# Altium schematic sheet EtherWiz_Sockets.SchDoc
size A3; SheetNumber: 3; SheetTotal: 3
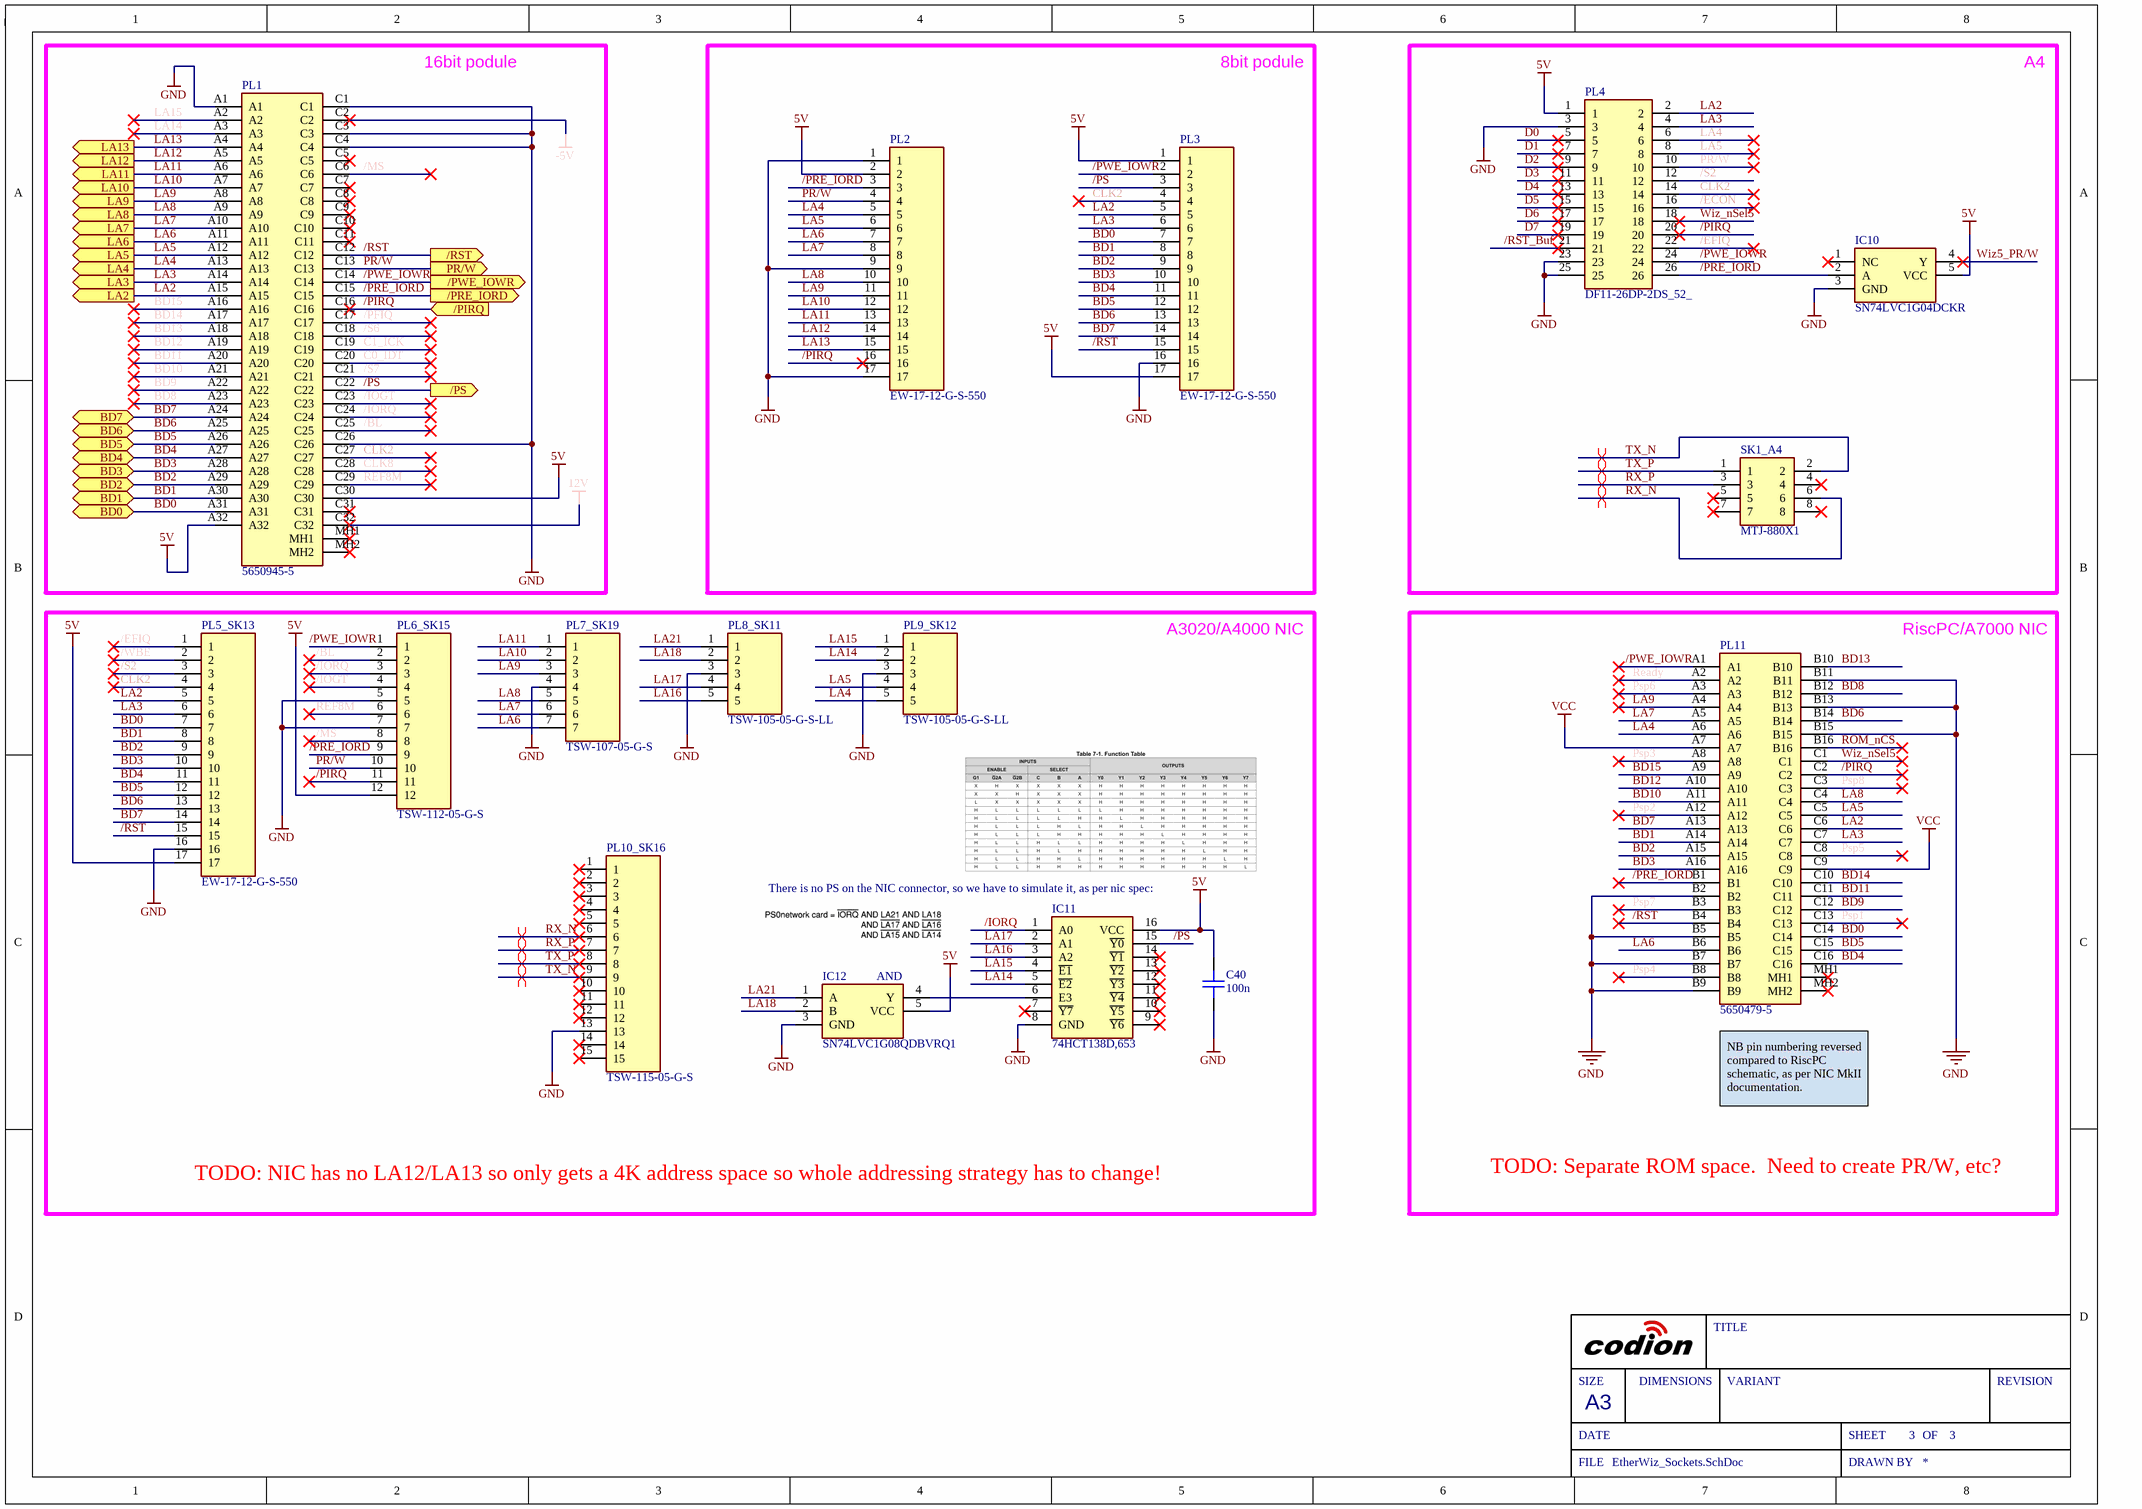
[diagram p0: EtherWiz_Sockets.SchDoc]

## Parts
C40  100n  [CAPC1608L]
IC10  SN74LVC1G04DCKR  [SOT65P210X110-5N]
IC11  74HCT138D,653  [SOIC127P600X175-16N]
IC12  SN74LVC1G08QDBVRQ1  [SOT95P280X145-5N]
PL1  5650945-5  [56509455]
PL2  EW-17-12-G-S-550  [TSW-117-XX-YY-S]
PL3  EW-17-12-G-S-550  [TSW-117-XX-YY-S]
PL4  DF11-26DP-2DS_52_  [SHDRRA26W50P200_2X13_2800X1000X500P]
PL5_SK13  EW-17-12-G-S-550  [TSW-117-XX-YY-S]
PL6_SK15  TSW-112-05-G-S  [TSW-112-XX-YY-S]
PL7_SK19  TSW-107-05-G-S  [TSW-107-XX-YY-S]
PL8_SK11  TSW-105-05-G-S-LL  [HDRV5W64P0X254_1X5_1270X254X521P]
PL9_SK12  TSW-105-05-G-S-LL  [HDRV5W64P0X254_1X5_1270X254X521P]
PL10_SK16  TSW-115-05-G-S  [TSW-115-XX-YY-S]
PL11  5650479-5  [56504795]
SK1_A4  MTJ-880X1  [MTJ880X1]

## Blocks framed on the sheet
16bit podule: PL1
8bit podule: PL2 PL3
A4: IC10 PL4 SK1_A4
A3020/A4000 NIC: C40 IC11 IC12 PL5_SK13 PL6_SK15 PL7_SK19 PL8_SK11 PL9_SK12 PL10_SK16
TODO: Separate ROM space.  Need to create PR/W, etc?: PL11

## Ports
/PIRQ (in, see EtherWiz[3D]), /PRE_IORD (out, see EtherWiz[6A]), /PS (out, see EtherWiz[6A]), /PWE_IOWR (out, see EtherWiz[6A]), /RST (out, see EtherWiz[2B]), BD0 (bidir, see EtherWiz[5B]), BD1 (bidir, see EtherWiz[5A]), BD2 (bidir, see EtherWiz[5A]), BD3 (bidir, see EtherWiz[5A]), BD4 (bidir, see EtherWiz[5A]), BD5 (bidir, see EtherWiz[5A]), BD6 (bidir, see EtherWiz[5A]), BD7 (bidir, see EtherWiz[5A]), LA2 (out, see EtherWiz[6A]), LA3 (out, see EtherWiz[6A]), LA4 (out, see EtherWiz[2B]), LA5 (out, see EtherWiz[2B]), LA6 (out, see EtherWiz[1B]), LA7 (out, see EtherWiz[1B]), LA8 (out, see EtherWiz[1B]), LA9 (out, see EtherWiz[1B]), LA10 (out, see EtherWiz[1A]), LA11 (out, see EtherWiz[1A]), LA12 (out, see EtherWiz[6A]), LA13 (out, see EtherWiz[6A]), PR/W (out, see EtherWiz[6A])

## Nets
5V: C40.2 IC10.5(VCC) IC11.16(VCC) IC12.5(VCC) PL1.A32 PL1.C30 PL2.2 PL3.1 PL3.17 PL4.1 PL5_SK13.17 PL6_SK15.12
12V: PL1.C32
-5V: PL1.C2
GND: C40.1 IC10.3(GND) IC11.8(GND) IC12.3(GND) PL1.A1 PL1.C1 PL1.C3 PL1.C4 PL1.C26 PL2.1 PL2.9 PL2.17 PL3.16 PL4.3 PL4.23 PL4.25 PL5_SK13.16 PL6_SK15.5 PL6_SK15.7 PL7_SK19.4 PL8_SK11.3 PL9_SK12.3 PL10_SK16.13 PL11.B2 PL11.B5 PL11.B7 PL11.B9 PL11.B11 PL11.B13 PL11.B15
VCC: PL11.A7 PL11.C9
/BL: PL1.C25 PL6_SK15.2
/ECON: PL4.16
/EFIQ: PL4.22 PL5_SK13.1
/IOGT: PL1.C23 PL6_SK15.4
/IORQ: IC11.1(A0) PL1.C24 PL6_SK15.3
/MS: PL1.C6 PL6_SK15.8
/PFIQ: PL1.C17
/PIRQ: PL1.C16 PL2.16 PL4.20 PL6_SK15.11 PL11.C2 ; port /PIRQ
/PRE_IORD: IC10.2(A) PL1.C15 PL2.3 PL4.26 PL6_SK15.9 PL11.B1 ; port /PRE_IORD
/PS: IC11.15(~{Y0}) PL1.C22 PL3.3 ; port /PS
/PWE_IOWR: PL1.C14 PL3.2 PL4.24 PL6_SK15.1 PL11.A1 ; port /PWE_IOWR
/RST: PL1.C12 PL3.15 PL5_SK13.15 PL11.B4 ; port /RST
/RST_Buf: PL4.21
/S2: PL4.12 PL5_SK13.3
/S6: PL1.C18
/S7: PL1.C21
/WBE: PL5_SK13.2
BD0: PL1.A31 PL3.7 PL5_SK13.7 PL11.C14 ; port BD0
BD1: PL1.A30 PL3.8 PL5_SK13.8 PL11.A14 ; port BD1
BD2: PL1.A29 PL3.9 PL5_SK13.9 PL11.A15 ; port BD2
BD3: PL1.A28 PL3.10 PL5_SK13.10 PL11.A16 ; port BD3
BD4: PL1.A27 PL3.11 PL5_SK13.11 PL11.C16 ; port BD4
BD5: PL1.A26 PL3.12 PL5_SK13.12 PL11.C15 ; port BD5
BD6: PL1.A25 PL3.13 PL5_SK13.13 PL11.B14 ; port BD6
BD7: PL1.A24 PL3.14 PL5_SK13.14 PL11.A13 ; port BD7
BD8: PL1.A23 PL11.B12
BD9: PL1.A22 PL11.C12
BD10: PL1.A21 PL11.A11
BD11: PL1.A20 PL11.C11
BD12: PL1.A19 PL11.A10
BD13: PL1.A18 PL11.B10
BD14: PL1.A17 PL11.C10
BD15: PL1.A16 PL11.A9
C0_IDT: PL1.C20
C1_ICK: PL1.C19
CLK2: PL1.C27 PL3.4 PL4.14 PL5_SK13.4
CLK8: PL1.C28
D0: PL4.5
D1: PL4.7
D2: PL4.9
D3: PL4.11
D4: PL4.13
D5: PL4.15
D6: PL4.17
D7: PL4.19
LA2: PL1.A15 PL3.5 PL4.2 PL5_SK13.5 PL11.C6 ; port LA2
LA3: PL1.A14 PL3.6 PL4.4 PL5_SK13.6 PL11.C7 ; port LA3
LA4: PL1.A13 PL2.5 PL4.6 PL9_SK12.5 PL11.A6 ; port LA4
LA5: PL1.A12 PL2.6 PL4.8 PL9_SK12.4 PL11.C5 ; port LA5
LA6: PL1.A11 PL2.7 PL7_SK19.7 PL11.B6 ; port LA6
LA7: PL1.A10 PL2.8 PL7_SK19.6 PL11.A5 ; port LA7
LA8: PL1.A9 PL2.10 PL7_SK19.5 PL11.C4 ; port LA8
LA9: PL1.A8 PL2.11 PL7_SK19.3 PL11.A4 ; port LA9
LA10: PL1.A7 PL2.12 PL7_SK19.2 ; port LA10
LA11: PL1.A6 PL2.13 PL7_SK19.1 ; port LA11
LA12: PL1.A5 PL2.14 ; port LA12
LA13: PL1.A4 PL2.15 ; port LA13
LA14: IC11.5(~{E2}) PL1.A3 PL9_SK12.2
LA15: IC11.4(~{E1}) PL1.A2 PL9_SK12.1
LA16: IC11.3(A2) PL8_SK11.5
LA17: IC11.2(A1) PL8_SK11.4
LA18: IC12.2(B) PL8_SK11.2
LA21: IC12.1(A) PL8_SK11.1
PR/W: PL1.C13 PL2.4 PL4.10 PL6_SK15.10 ; port PR/W
Psp1: PL11.C13
Psp2: PL11.A12
Psp3: PL11.A8
Psp4: PL11.B8
Psp5: PL11.C8
Psp6: PL11.A3
Psp7: PL11.B3
Psp8: PL11.C3
Ready: PL11.A2
REF8M: PL1.C29 PL6_SK15.6
ROM_nCS: PL11.B16
RX_N: PL10_SK16.6 SK1_A4.6
RX_P: PL10_SK16.7 SK1_A4.3
TX_N: PL10_SK16.9 SK1_A4.2
TX_P: PL10_SK16.8 SK1_A4.1
Wiz5_PR/W: IC10.4(Y)
Wiz_nSel5: PL4.18 PL11.C1
NetIC11_6: IC11.6(E3) IC12.4(Y)

Not connected (* = marked no-connect by the designer): IC10 1(NC)*; IC11 7(~{Y7})* 9(~{Y6})* 10(~{Y5})* 11(~{Y4})* 12(~{Y3})* 13(~{Y2})* 14(~{Y1})*; PL1 C5* C7* C8* C9* C10* C11* C31* MH1* MH2*; PL10_SK16 1* 2* 3* 4* 5* 10* 11* 12* 14* 15*; PL11 MH1* MH2*; SK1_A4 4* 5* 7* 8*

## Layout directives
differential pair: RX_N, RX_P, TX_N, TX_P

## Notes on the sheet
- RiscPC/A7000 NIC
- (near IC11) There is no PS on the NIC connector, so we have to simulate it, as per nic spec:
- (near IC12) AND
- (near PL11) NB pin numbering reversed compared to RiscPC schematic, as per NIC MkII documentation.
- TODO: NIC has no LA12/LA13 so only gets a 4K address space so whole addressing strategy has to change!
- SIZE
- DIMENSIONS
- TITLE
- VARIANT
- REVISION
- DATE
- A3
- SHEET
- OF
- FILE
- DRAWN BY

## Library data of the parts
C40 = CAP_100n_0603_50V_0: CAP 100nF, 0603, 50V, X7R, 10%; Manufacturer1: Samsung; ManuPart1: CL10B104KB8NNNC; ManuPart2: CC0603KRX7R9BB104; Value: 100n; Distributor1: Anglia; Manufacturer2: Yageo; Distributor2: Digikey; Distributor1 Part No: CL10B104KB8NNNC; Distributor2 Part No: 311-1344-2-ND; ComponentLinknURL: *; ComponentLink1Description: ComponentLinknURL1; ComponentLink1URL: https://media.digikey.com/pdf/Data%20Sheets/Samsung%20PDFs/CL_Series_MLCC_ds.pdf; ComponentLink2Description: ComponentLinknURL2; ComponentLink2URL: https://www.yageo.com/upload/media/product/productsearch/datasheet/mlcc/UPY-GPHC_X7R_6.3V-to-50V_18.pdf; Voltage: 50V
IC10 = SN74LVC1G04DCKR: Integrated Circuit; Manufacturer_Name: Texas Instruments; Datasheet Link: http://www.ti.com/lit/ds/symlink/sn74lvc1g04.pdf; Height: 1.1mm; Manufacturer_Part_Number: SN74LVC1G04DCKR; Mouser Part Number: 595-SN74LVC1G04DCKR; Mouser Price/Stock: https://www.mouser.co.uk/ProductDetail/Texas-Instruments/SN74LVC1G04DCKR?qs=dT9u2OTAaVWNPsQmeXyvkg%3D%3D; Arrow Part Number: SN74LVC1G04DCKR; Arrow Price/Stock: https://www.arrow.com/en/products/sn74lvc1g04dckr/texas-instruments?region=nac
IC11 = 74HCT138D,653: Integrated Circuit; Manufacturer_Name: Nexperia; Datasheet Link: https://assets.nexperia.com/documents/data-sheet/74HC_HCT138.pdf; Height: 1.75mm; Manufacturer_Part_Number: 74HCT138D,653; Mouser Part Number: 771-74HCT138D-T; Mouser Price/Stock: https://www.mouser.co.uk/ProductDetail/Nexperia/74HCT138D653?qs=P62ublwmbi8MKahyK7iY6g%3D%3D; Arrow Part Number: 74HCT138D,653; Arrow Price/Stock: https://www.arrow.com/en/products/74hct138d653/nexperia?region=nac
IC12 = SN74LVC1G08QDBVRQ1: Integrated Circuit; Manufacturer_Name: Texas Instruments; Datasheet Link: http://www.ti.com/lit/ds/symlink/sn74lvc1g08-q1.pdf; Height: 1.45mm; Manufacturer_Part_Number: SN74LVC1G08QDBVRQ1; Mouser Part Number: 595-SN74LVC1G08QDBQ1; Mouser Price/Stock: https://www.mouser.co.uk/ProductDetail/Texas-Instruments/SN74LVC1G08QDBVRQ1?qs=PVVDbbWpW3K%252BPBrUmLG6eg%3D%3D; Arrow Part Number: SN74LVC1G08QDBVRQ1; Arrow Price/Stock: https://www.arrow.com/en/products/sn74lvc1g08qdbvrq1/texas-instruments?utm_currency=USD&region=nac
PL1 = 5650945-5: Connector; Manufacturer_Name: TE Connectivity; Datasheet Link: https://www.te.com/commerce/DocumentDelivery/DDEController?Action=showdoc&DocId=Customer+Drawing%7F650473%7FS%7Fpdf%7FEnglish%7FENG_CD_650473_S_baseFilename.pdf%7F5650945-5; Height: 11.1mm; Manufacturer_Part_Number: 5650945-5; Mouser Part Number: 571-5650945-5; Mouser Price/Stock: https://www.mouser.co.uk/ProductDetail/TE-Connectivity/5650945-5?qs=%2FFe7VTH785B%252B77b5t925bQ%3D%3D; Arrow Part Number: 5650945-5; Arrow Price/Stock: https://www.arrow.com/en/products/5650945-5/te-connectivity
PL2 PL3 PL5_SK13 = TSW-117-05-G-S: Connector; Manufacturer_Name: SAMTEC; Datasheet Link: http://suddendocs.samtec.com/prints/tsw-xxx-xx-xxx-x-xx-xxx-mkt.pdf; Manufacturer_Part_Number: TSW-117-05-G-S
PL4 = DF11-26DP-2DS_52_: Connector; Manufacturer_Name: Hirose; Manufacturer_Part_Number: DF11-26DP-2DS(52); Datasheet Link: https://www.hirose.com/product/document?clcode=CL0543-0544-8-52&productname=DF11-26DP-2DS(52)&series=DF11&documenttype=2DDrawing&lang=en&documentid=0000995291; Height: 5mm; Mouser Part Number: 798-DF11-26DP-2DS52; Mouser Price/Stock: https://www.mouser.co.uk/ProductDetail/Hirose-Connector/DF11-26DP-2DS52?qs=Ux3WWAnHpjAoQVMFZWdmwg%3D%3D; Arrow Part Number: DF11-26DP-2DS(52); Arrow Price/Stock: https://www.arrow.com/en/products/df11-26dp-2ds-52/hirose-electric
PL6_SK15 = TSW-112-05-G-S: Connector; Manufacturer_Name: SAMTEC; Datasheet Link: http://suddendocs.samtec.com/prints/tsw-xxx-xx-xxx-x-xx-xxx-mkt.pdf; Manufacturer_Part_Number: TSW-112-05-G-S
PL7_SK19 = TSW-107-05-G-S: Connector; Manufacturer_Name: SAMTEC; Datasheet Link: http://suddendocs.samtec.com/prints/tsw-xxx-xx-xxx-x-xx-xxx-mkt.pdf; Manufacturer_Part_Number: TSW-107-05-G-S
PL8_SK11 PL9_SK12 = TSW-105-05-G-S-LL: Connector; Manufacturer_Name: SAMTEC; Datasheet Link: https://componentsearchengine.com/Datasheets/2/TSW-105-05-G-S-LL.pdf; Height: 5.21mm; Manufacturer_Part_Number: TSW-105-05-G-S-LL
PL10_SK16 = TSW-115-05-G-S: Connector; Manufacturer_Name: SAMTEC; Datasheet Link: http://suddendocs.samtec.com/prints/tsw-xxx-xx-xxx-x-xx-xxx-mkt.pdf; Manufacturer_Part_Number: TSW-115-05-G-S
PL11 = 5650479-5: Connector; Manufacturer_Name: TE Connectivity; Datasheet Link: https://www.te.com/commerce/DocumentDelivery/DDEController?Action=showdoc&DocId=Customer+Drawing%7F5650479%7FP%7Fpdf%7FEnglish%7FENG_CD_5650479_P.pdf%7F5650479-5; Height: 11.61mm; Manufacturer_Part_Number: 5650479-5; Mouser Part Number: 571-5650479-5; Mouser Price/Stock: https://www.mouser.co.uk/ProductDetail/TE-Connectivity/5650479-5?qs=xrnNvQC1SKQu%252BZBLSdOcFw%3D%3D; Arrow Part Number: 5650479-5; Arrow Price/Stock: https://www.arrow.com/en/products/5650479-5/te-connectivity?region=europe
SK1_A4 = MTJ-880X1: Connector; Manufacturer_Name: Adam Tech; Datasheet Link: https://app.adam-tech.com/products/download/data_sheet/203795/mtj-880x1-data-sheet.pdf; Height: 12.9794mm; Manufacturer_Part_Number: MTJ-880X1; Mouser Part Number: 737-MTJ-880X1; Mouser Price/Stock: https://www.mouser.co.uk/ProductDetail/Adam-Tech/MTJ-880X1?qs=TTVbHWoAP%2FTHQFSSStritA%3D%3D; Arrow Part Number: MTJ-880X1; Arrow Price/Stock: https://www.arrow.com/en/products/mtj-880x1/adam-tech?region=nac